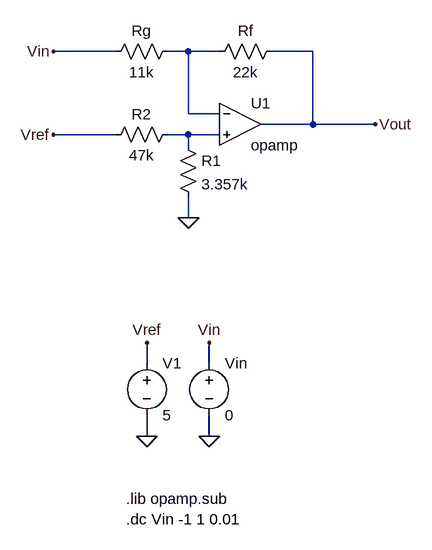
[diagram p0: schematic mnbp.asc]
mnbp.asc, the LTspice schematic file:
Version 4
SHEET 1 880 800
WIRE 16 64 -80 64
WIRE 128 64 96 64
WIRE 176 64 128 64
WIRE 320 64 256 64
WIRE 128 160 128 64
WIRE 176 160 128 160
WIRE 320 176 320 64
WIRE 320 176 240 176
WIRE 416 176 320 176
WIRE 16 192 -80 192
WIRE 128 192 96 192
WIRE 176 192 128 192
WIRE 128 208 128 192
WIRE 128 320 128 288
WIRE 64 544 64 512
WIRE 160 544 160 512
WIRE 64 656 64 624
WIRE 160 656 160 624
FLAG 64 512 Vref
FLAG 64 656 0
FLAG 160 656 0
FLAG -80 64 Vin
FLAG 416 176 Vout
FLAG 160 512 Vin
FLAG 128 320 0
FLAG -80 192 Vref
SYMBOL voltage 160 528 R0
SYMATTR InstName Vin
SYMATTR Value 0
SYMBOL res 272 48 R90
WINDOW 0 0 56 VBottom 2
WINDOW 3 32 56 VTop 2
SYMATTR InstName Rf
SYMATTR Value 22k
SYMBOL res 112 48 R90
WINDOW 0 0 56 VBottom 2
WINDOW 3 32 56 VTop 2
SYMATTR InstName Rg
SYMATTR Value 11k
SYMBOL voltage 64 528 R0
SYMATTR InstName V1
SYMATTR Value 5
SYMBOL Opamps\\opamp 208 112 R0
SYMATTR InstName U1
SYMBOL res 112 192 R0
SYMATTR InstName R1
SYMATTR Value 3.357k
SYMBOL res 112 176 R90
WINDOW 0 0 56 VBottom 2
WINDOW 3 32 56 VTop 2
SYMATTR InstName R2
SYMATTR Value 47k
TEXT 32 784 Left 2 !.dc Vin -1 1 0.01
TEXT 32 752 Left 2 !.lib opamp.sub

The netlist it stands for:
* mnbp.asc
Vin Vin 0 0
Rf Vout N001 22k
Rg N001 Vin 11k
V1 Vref 0 5
XU1 N001 N002 Vout opamp Aol=100K GBW=10Meg  ; pins invin noninvin out
R1 N002 0 3.357k
R2 N002 Vref 47k
.dc Vin -1 1 0.01
.lib opamp.sub
.backanno
.end